# EAGLE schematic AR - Attack Release (EAGLE 6.6.0)

## Sheet 1 of 2
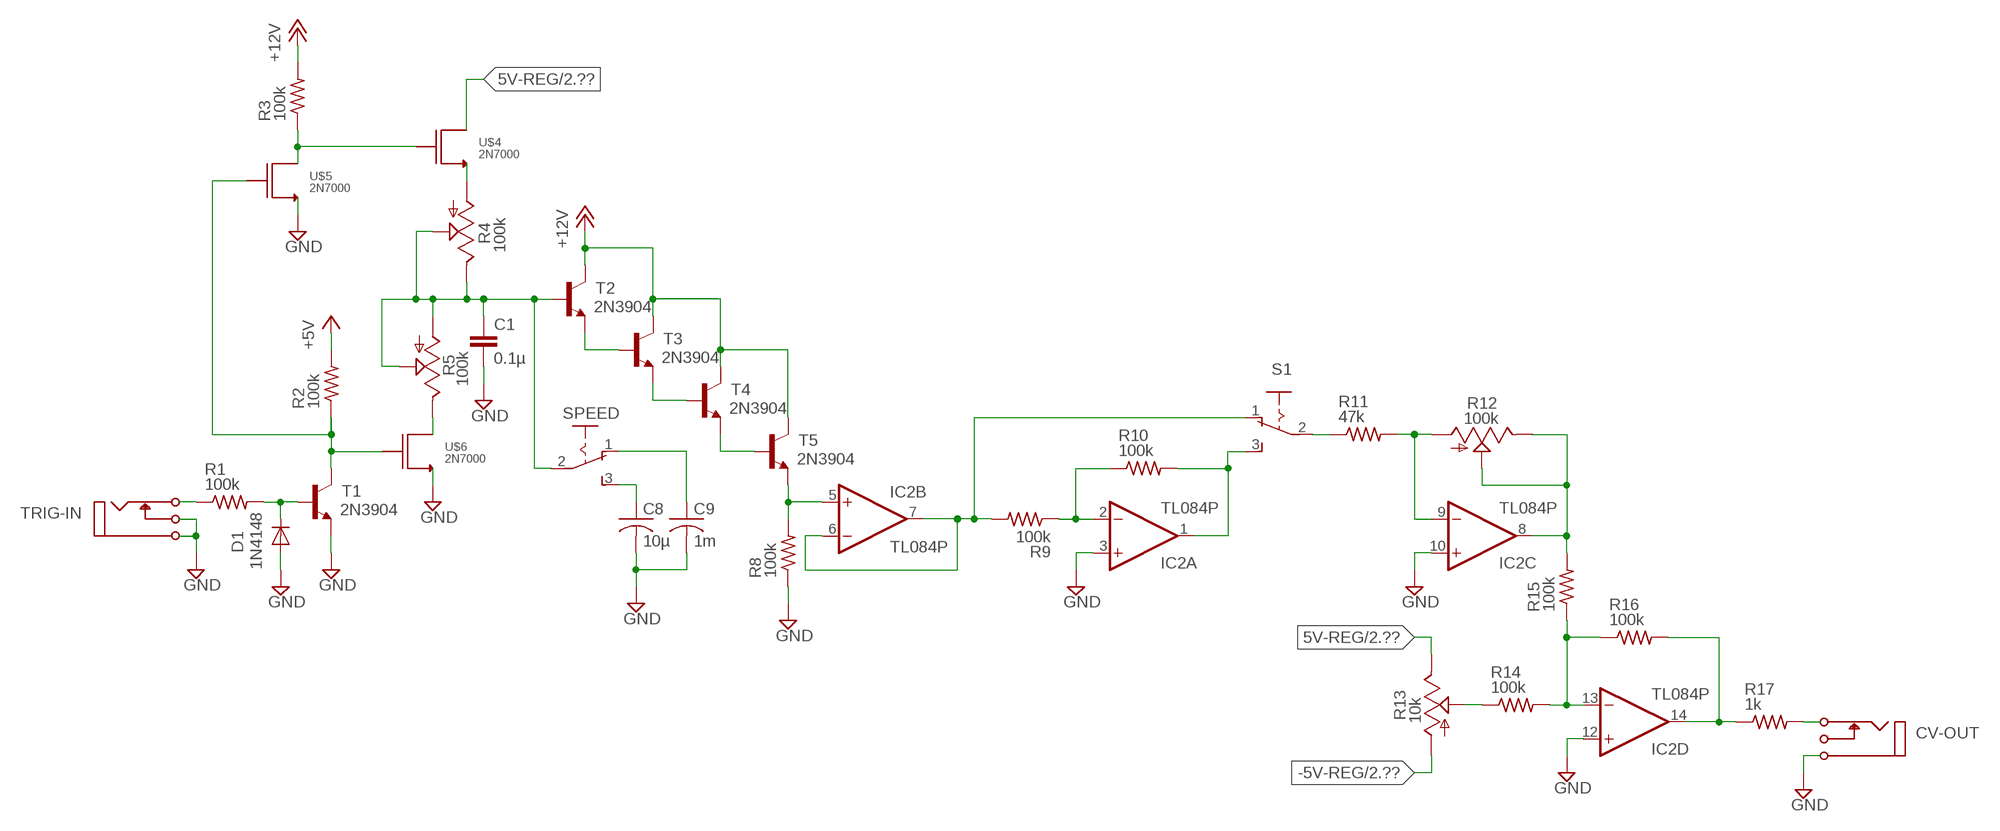
[diagram p0: schematic, sheet 1]

### Parts
C1  0.1µ  C2.5/2  [C2.5-2]
C8  10µ  C-US025-050X050  [C025-050X050]
C9  1m  C-US025-050X050  [C025-050X050]
CV-OUT  I/O  MONO_JACK  [MONO_JACK]
D1  1N4148  1N4148DO35-7  [DO35-7]
IC2  TL084P  [DIL14]
R1  100k  R-US_0204/7  [0204/7]
R2  100k  R-US_0204/7  [0204/7]
R3  100k  R-US_0204/7  [0204/7]
R4  100k  TRIM_US-B64Y  [B64Y]
R5  100k  TRIM_US-B64Y  [B64Y]
R8  100k  R-US_0204/7  [0204/7]
R9  100k  R-US_0204/7  [0204/7]
R10  100k  R-US_0204/7  [0204/7]
R11  47k  R-US_0204/7  [0204/7]
R12  100k  TRIM_US-B64Y  [B64Y]
R13  10k  TRIM_US-B64Y  [B64Y]
R14  100k  R-US_0204/7  [0204/7]
R15  100k  R-US_0204/7  [0204/7]
R16  100k  R-US_0204/7  [0204/7]
R17  1k  R-US_0204/7  [0204/7]
S1  255SB  [255SB]
SPEED  255SB  [255SB]
T1  2N3904  [TO92]
T2  2N3904  [TO92]
T3  2N3904  [TO92]
T4  2N3904  [TO92]
T5  2N3904  [TO92]
TRIG-IN  I/O  MONO_JACK  [MONO_JACK]
U$4  2N7000  [2N7000]
U$5  2N7000  [2N7000]
U$6  2N7000  [2N7000]

### Nets
5V-REG: R13.E U$4.D ; also sheet 2
+5V: R2.2
+12V: R3.2 T2.1(C) T3.1(C) T4.1(C) T5.1(C) ; also sheet 2
+12V1: C8.1 SPEED.3(S)
-5V-REG: R13.A ; also sheet 2
GND: C1.2 C8.2 C9.2 CV-OUT.P$1 D1.A IC2.3(A:+IN) IC2.10(C:+IN) IC2.12(D:+IN) R8.1 T1.3(E) TRIG-IN.P$1 TRIG-IN.P$3(P3) U$5.S U$6.S ; also sheet 2
N$1: R1.1 TRIG-IN.P$2(P2)
N$2: D1.C R1.2 T1.2(B)
N$3: R2.1 T1.1(C) U$5.G U$6.G
N$4: R3.1 U$4.G U$5.D
N$5: IC2.13(D:-IN) R14.2 R15.1 R16.1
N$6: T3.3(E) T4.2(B)
N$7: R5.E U$6.D
N$8: C1.1 R4.E R4.S R5.A R5.S SPEED.2(P) T2.2(B)
N$9: R4.A U$4.S
N$13: T2.3(E) T3.2(B)
N$14: T4.3(E) T5.2(B)
N$15: IC2.1(A:OUT) R10.2 S1.3(S)
N$16: IC2.5(B:+IN) R8.2 T5.3(E)
N$17: IC2.6(B:-IN) IC2.7(B:OUT) R9.2 S1.1(O)
N$18: IC2.2(A:-IN) R9.1 R10.1
N$19: R11.1 S1.2(P)
N$20: IC2.9(C:-IN) R11.2 R12.A
N$21: R13.S R14.1
N$22: IC2.14(D:OUT) R16.2 R17.1
N$23: IC2.8(C:OUT) R12.E R12.S R15.2
N$25: CV-OUT.P$2(P2) R17.2
N$26: C9.1 SPEED.1(O)
Unconnected: CV-OUT.P$3(P3)

## Sheet 2 of 2: Power
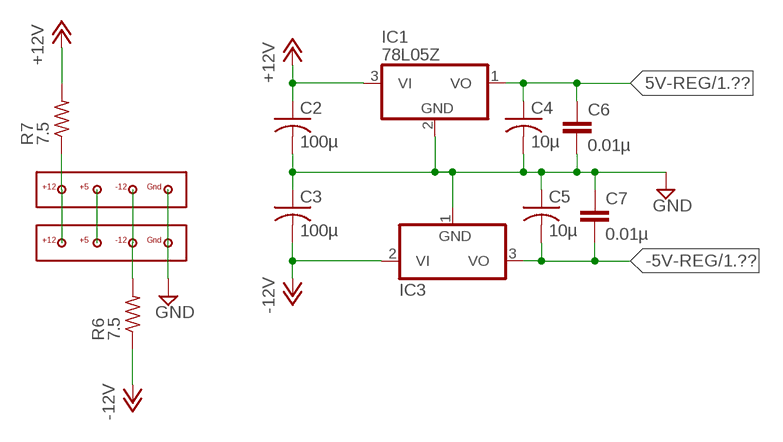
[diagram p1: schematic, sheet 2]

### Parts
C2  100µ  C-US025-050X050  [C025-050X050]
C3  100µ  C-US025-050X050  [C025-050X050]
C4  10µ  C-US025-050X050  [C025-050X050]
C5  10µ  C-US025-050X050  [C025-050X050]
C6  0.01µ  C2.5/2  [C2.5-2]
C7  0.01µ  C2.5/2  [C2.5-2]
IC1  78L05Z  [TO92]
IC3  79L05Z  [TO92]
R6  7.5  R-US_0204/7  [0204/7]
R7  7.5  R-US_0204/7  [0204/7]
U$3  POWER_CONNECTOR_4_RGBB  [POWER_CONNECTOR_4_RGBB]
U$7  POWER_CONNECTOR_4_RGBB  [POWER_CONNECTOR_4_RGBB]

### Nets
5V-REG: C4.1 C6.1 IC1.1(VO) ; also sheet 1
+12V: C2.1 IC1.3(VI) R7.2 ; also sheet 1
-5V-REG: C5.2 C7.2 IC3.3(VO) ; also sheet 1
-12V: C3.2 IC3.2(VI) R6.1
GND: C2.2 C3.1 C4.2 C5.1 C6.2 C7.1 IC1.2(GND) IC3.1(GND) U$3.GND U$7.GND ; also sheet 1
N$10: R7.1 U$3.+12 U$7.+12
N$11: U$3.+5 U$7.+5
N$12: R6.2 U$3.-12 U$7.-12

## Power pins joined to a net without a drawn wire
V+: IC2.4(P:V+)
V-: IC2.11(P:V-)

## Library data of the parts
C1 C6 C7 = capacitor-wima:C: CAPACITOR naming: grid - package width
C2-C5 C8 C9 = rcl:C-US: CAPACITOR, American symbol
CV-OUT TRIG-IN = !synth_sch:MONO_JACK
D1 = diode:1N4148: DIODE high speed (Philips)
IC1 = linear:78*: Positive VOLTAGE REGULATOR Source: http://cache.national.com/ds/LM/LM78L05.pdf http://www.fairchildsemi.com/ds/LM/LM7805.pdf
IC2 = linear:TL084: OP AMP
IC3 = linear:79*: Negative VOLTAGE REGULATOR
R1-R3 R6-R11 R14-R17 = resistor:R-US_: RESISTOR, American symbol
R4 R5 R12 R13 = pot:TRIM_US-: POTENTIOMETER
S1 SPEED = switch:255SB: SLIDING SWITCH Distributor Buerklin, 11G810
T1-T5 = transistor:2N3904: NPN TRANSISTOR
U$3 U$7 = !synth_sch:POWER_CONNECTOR_4_RGBB
U$4-U$6 = !synth_sch:2N7000